# EAGLE schematic Schmatic (EAGLE 9.5.0)
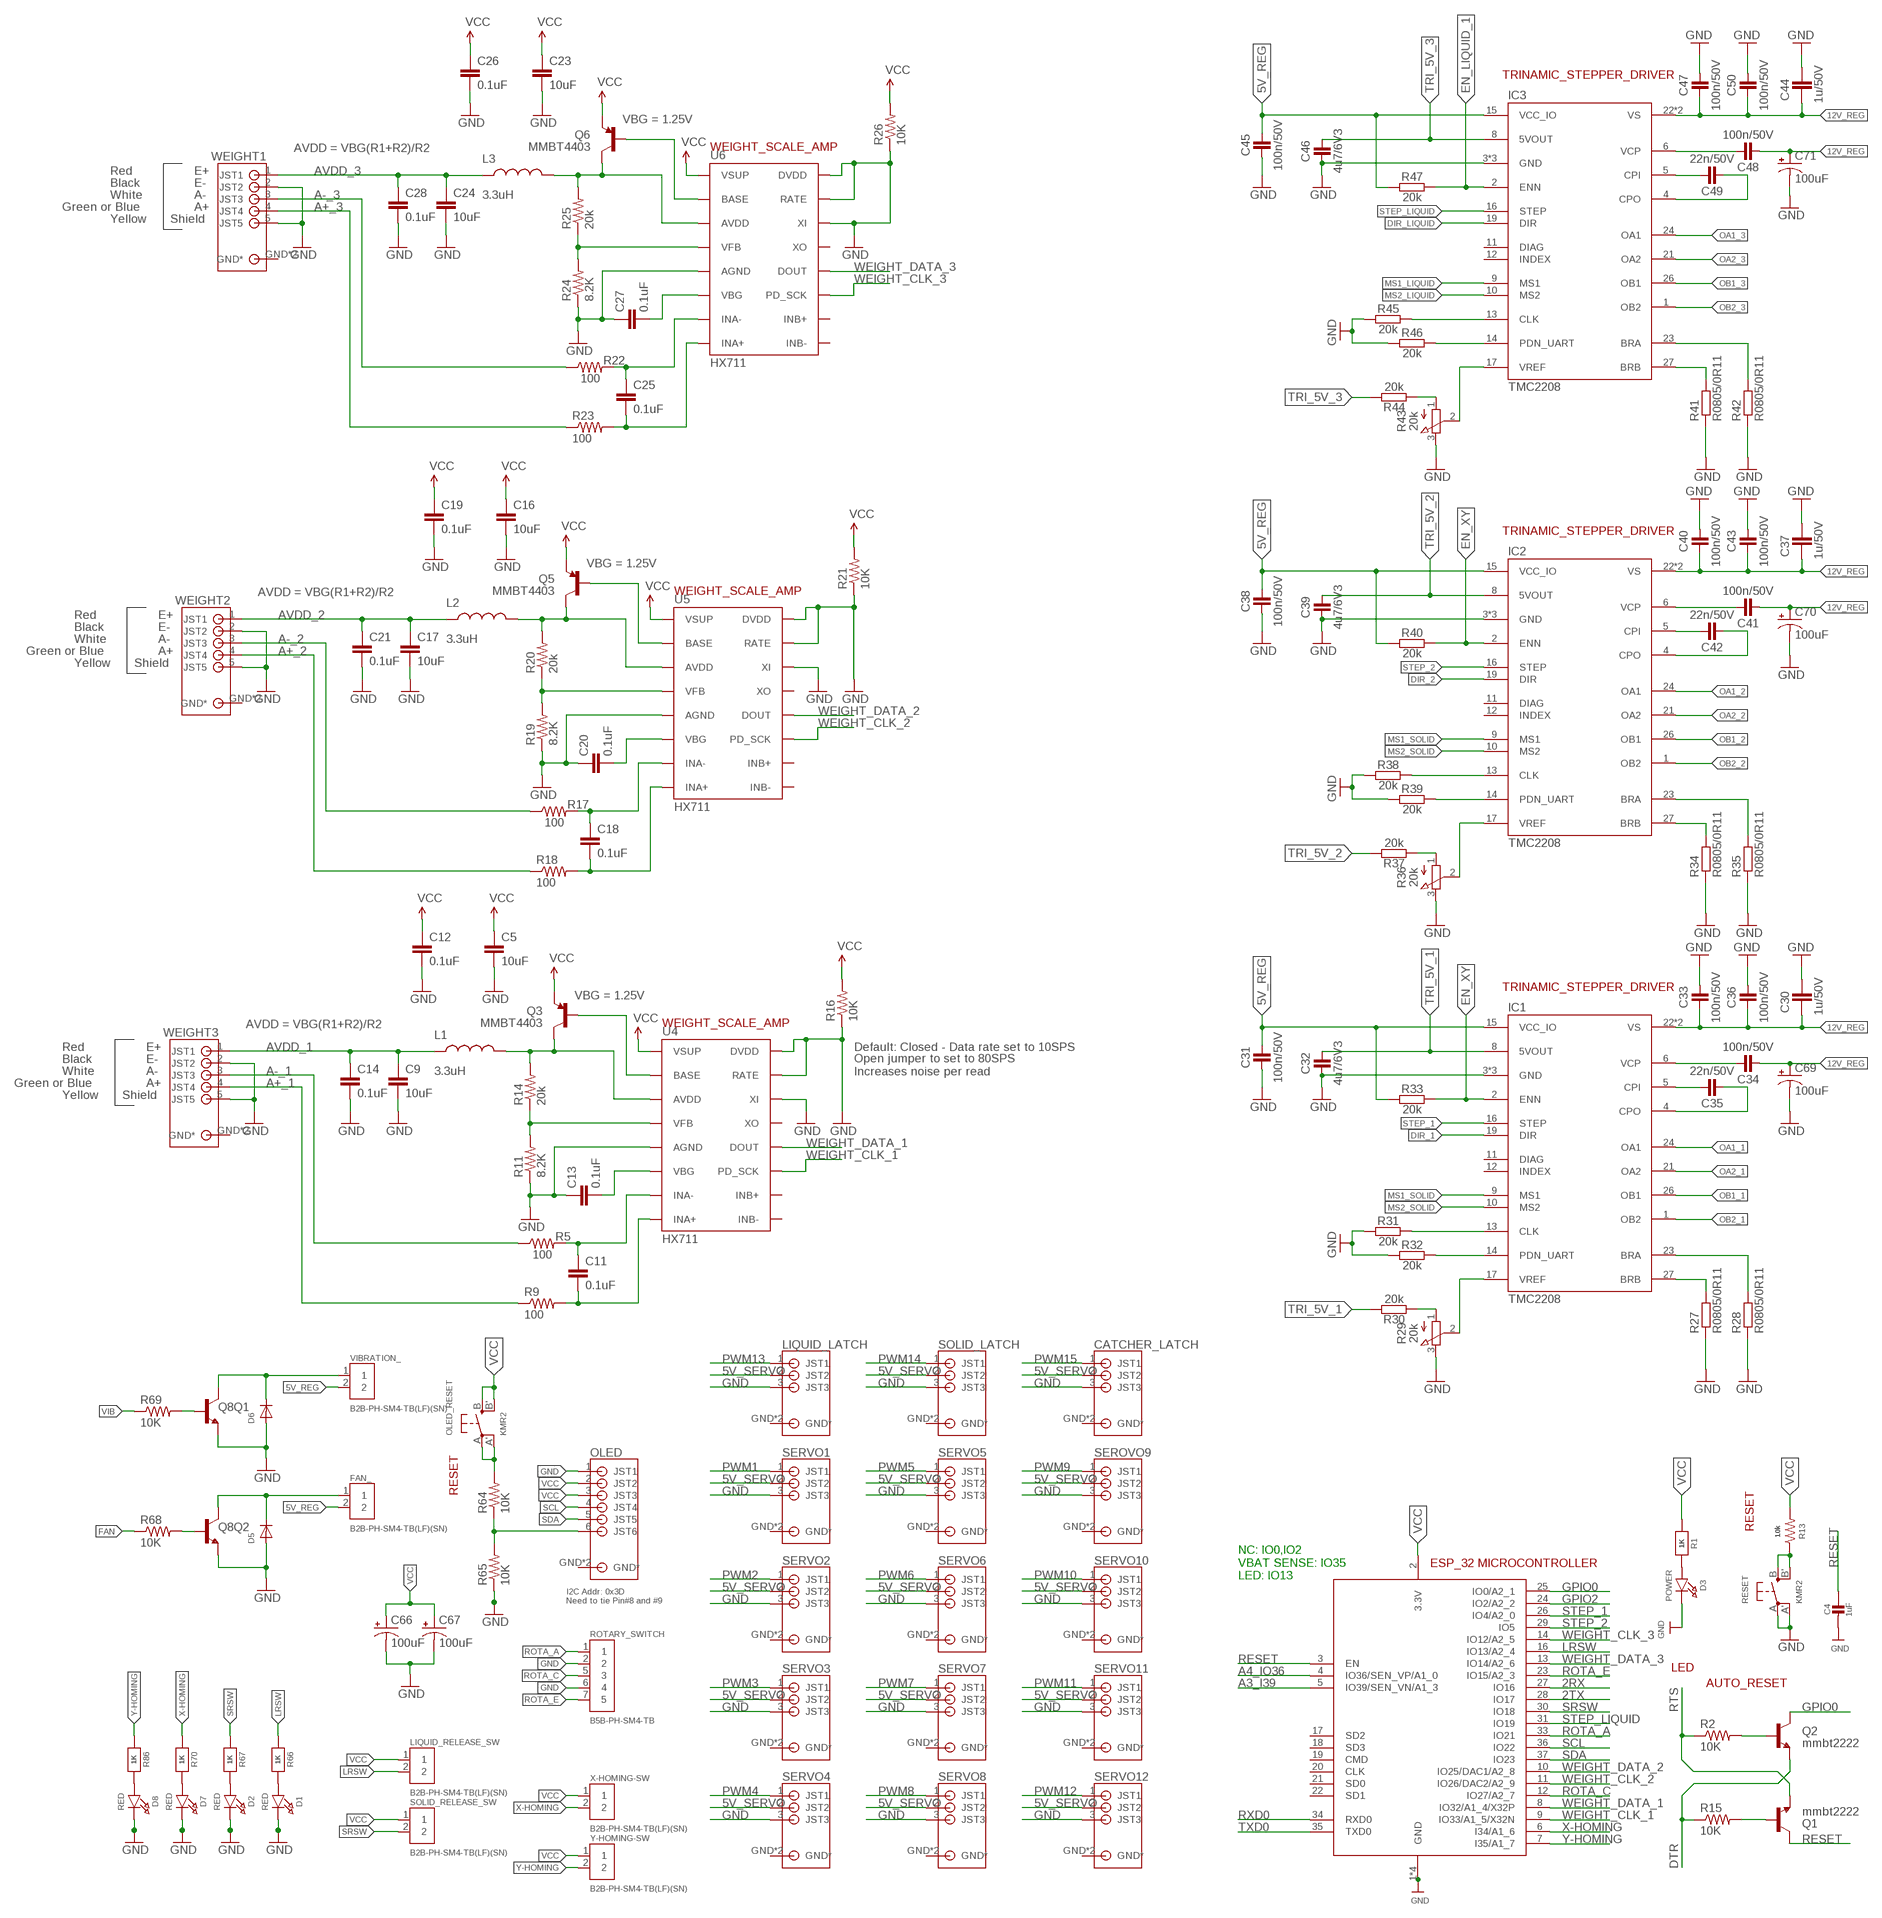
[diagram p0: schematic, sheet 1, part 1 of 2]
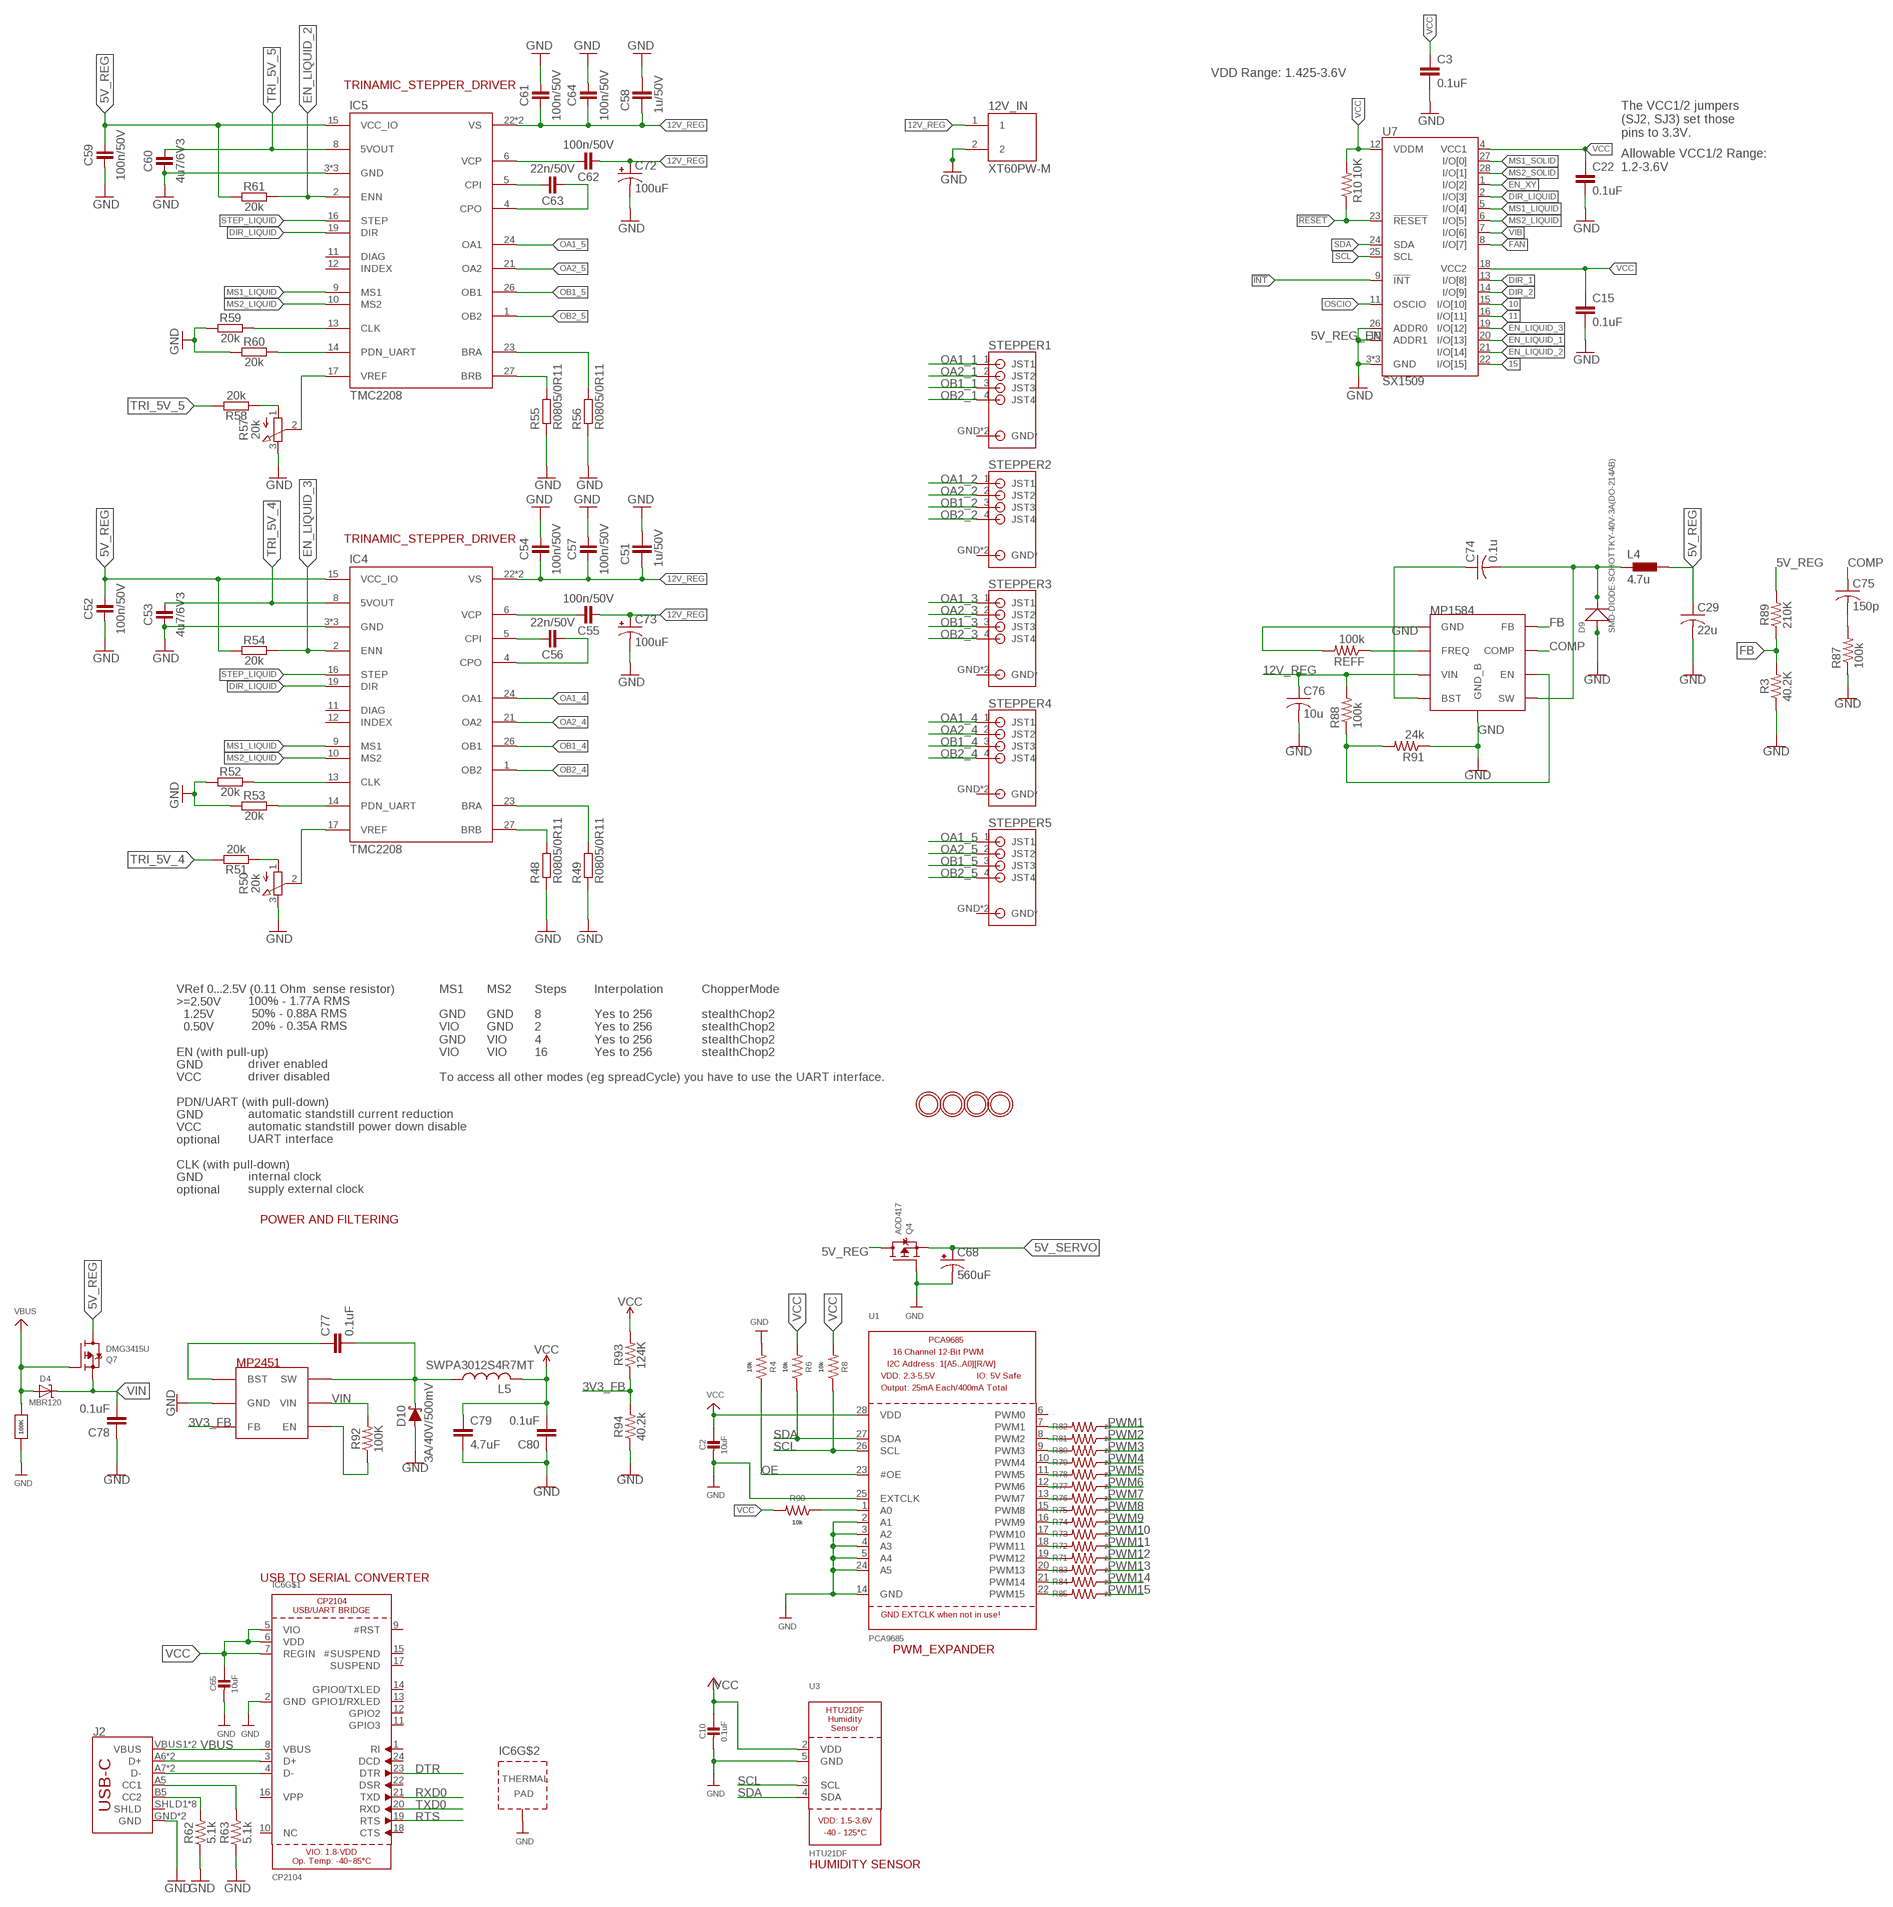
[diagram p1: schematic, sheet 1, part 2 of 2]

## Parts
12V_IN  XT60PW-M  [AMASS_XT60PW-M]
C2  10uF  CAP_CERAMIC0805-NOOUTLINE  [0805-NO]
C3  0.1uF  0.1UF-25V(+80/-20%)(0603)  [0603-CAP]
C4  1uF  CAP_CERAMIC0603_NO  [0603-NO]
C5  10uF  10UF50V20%(1210)  [1210]
C9  10uF  10UF50V20%(1210)  [1210]
C10  0.1uF  CAP_CERAMIC0805-NOOUTLINE  [0805-NO]
C11  0.1uF  0.1UF-25V-5%(0603)  [0603-CAP@1]
C12  0.1uF  0.1UF-25V-5%(0603)  [0603-CAP@1]
C13  0.1uF  0.1UF-25V-5%(0603)  [0603-CAP@1]
C14  0.1uF  0.1UF-25V-5%(0603)  [0603-CAP@1]
C15  0.1uF  0.1UF-25V(+80/-20%)(0603)  [0603-CAP]
C16  10uF  10UF50V20%(1210)  [1210]
C17  10uF  10UF50V20%(1210)  [1210]
C18  0.1uF  0.1UF-25V-5%(0603)  [0603-CAP@1]
C19  0.1uF  0.1UF-25V-5%(0603)  [0603-CAP@1]
C20  0.1uF  0.1UF-25V-5%(0603)  [0603-CAP@1]
C21  0.1uF  0.1UF-25V-5%(0603)  [0603-CAP@1]
C22  0.1uF  0.1UF-25V(+80/-20%)(0603)  [0603-CAP]
C23  10uF  10UF50V20%(1210)  [1210]
C24  10uF  10UF50V20%(1210)  [1210]
C25  0.1uF  0.1UF-25V-5%(0603)  [0603-CAP@1]
C26  0.1uF  0.1UF-25V-5%(0603)  [0603-CAP@1]
C27  0.1uF  0.1UF-25V-5%(0603)  [0603-CAP@1]
C28  0.1uF  0.1UF-25V-5%(0603)  [0603-CAP@1]
C29  22u  C-USC1206  [C1206]
C30  1u/50V  C-EUC0805  [C0805]
C31  100n/50V  CAPACITOR-0402  [C0402]
C32  4u7/6V3  CAPACITOR-0402  [C0402]
C33  100n/50V  CAPACITOR-0402  [C0402]
C34  100n/50V  CAPACITOR-0402  [C0402]
C35  22n/50V  CAPACITOR-0402  [C0402]
C36  100n/50V  CAPACITOR-0402  [C0402]
C37  1u/50V  C-EUC0805  [C0805]
C38  100n/50V  CAPACITOR-0402  [C0402]
C39  4u7/6V3  CAPACITOR-0402  [C0402]
C40  100n/50V  CAPACITOR-0402  [C0402]
C41  100n/50V  CAPACITOR-0402  [C0402]
C42  22n/50V  CAPACITOR-0402  [C0402]
C43  100n/50V  CAPACITOR-0402  [C0402]
C44  1u/50V  C-EUC0805  [C0805]
C45  100n/50V  CAPACITOR-0402  [C0402]
C46  4u7/6V3  CAPACITOR-0402  [C0402]
C47  100n/50V  CAPACITOR-0402  [C0402]
C48  100n/50V  CAPACITOR-0402  [C0402]
C49  22n/50V  CAPACITOR-0402  [C0402]
C50  100n/50V  CAPACITOR-0402  [C0402]
C51  1u/50V  C-EUC0805  [C0805]
C52  100n/50V  CAPACITOR-0402  [C0402]
C53  4u7/6V3  CAPACITOR-0402  [C0402]
C54  100n/50V  CAPACITOR-0402  [C0402]
C55  100n/50V  CAPACITOR-0402  [C0402]
C56  22n/50V  CAPACITOR-0402  [C0402]
C57  100n/50V  CAPACITOR-0402  [C0402]
C58  1u/50V  C-EUC0805  [C0805]
C59  100n/50V  CAPACITOR-0402  [C0402]
C60  4u7/6V3  CAPACITOR-0402  [C0402]
C61  100n/50V  CAPACITOR-0402  [C0402]
C62  100n/50V  CAPACITOR-0402  [C0402]
C63  22n/50V  CAPACITOR-0402  [C0402]
C64  100n/50V  CAPACITOR-0402  [C0402]
C65  10uF  CAP_CERAMIC0805-NOOUTLINE  [0805-NO]
C66  100uF  100UF-POLAR-25V-20%(ELEC)  [PANASONIC_D]
C67  100uF  100UF-POLAR-25V-20%(ELEC)  [PANASONIC_D]
C68  560uF  560UF-PANASONIC_G-25V-20%  [PANASONIC_G]
C69  100uF  100UF-POLAR-25V-20%(ELEC)  [PANASONIC_D]
C70  100uF  100UF-POLAR-25V-20%(ELEC)  [PANASONIC_D]
C71  100uF  100UF-POLAR-25V-20%(ELEC)  [PANASONIC_D]
C72  100uF  100UF-POLAR-25V-20%(ELEC)  [PANASONIC_D]
C73  100uF  100UF-POLAR-25V-20%(ELEC)  [PANASONIC_D]
C74  0.1u  C-USC0603  [C0603]
C75  150p  C-USC0603  [C0603]
C76  10u  C-USC1206  [C1206]
C77  0.1uF  0.1UF-0603-25V-(+80/-20%)  [0603]
C78  0.1uF  0.1UF-0603-25V-(+80/-20%)  [0603]
C79  4.7uF  4.7UF-1206-16V-(+80/-20%)  [1206]
C80  0.1uF  0.1UF-0603-25V-(+80/-20%)  [0603]
CATCHER_LATCH  S3B-PH-SM4_TB  [S3B-PH-SM4_TB]
D1  RED  LED0805_NOOUTLINE  [CHIPLED_0805_NOOUTLINE]
D2  RED  LED0805_NOOUTLINE  [CHIPLED_0805_NOOUTLINE]
D3  POWER  LED0805_NOOUTLINE  [CHIPLED_0805_NOOUTLINE]
D4  MBR120  DIODE-SCHOTTKYSOD-123  [SOD-123]
D5  DIODESOD-323F  [SOD-323F]
D6  DIODESOD-323F  [SOD-323F]
D7  RED  LED0805_NOOUTLINE  [CHIPLED_0805_NOOUTLINE]
D8  RED  LED0805_NOOUTLINE  [CHIPLED_0805_NOOUTLINE]
D9  SMD-DIODE-SCHOTTKY-40V-3A(DO-214AB)  [DO-214AB]
D10  3A/40V/500mV  DIODE-SCHOTTKY-B340A  [SMA-DIODE]
FAN_  B2B-PH-SM4-TB(LF)(SN)  [JST_B2B-PH-SM4-TB(LF)(SN)]
IC1  TMC2208  [QFN28-PAD]
IC2  TMC2208  [QFN28-PAD]
IC3  TMC2208  [QFN28-PAD]
IC4  TMC2208  [QFN28-PAD]
IC5  TMC2208  [QFN28-PAD]
IC6  CP2104  [QFN24_4MM_SMSC]
J2  USB_C16PIN  [USB-C-16P]
L1  3.3uH  INDUCTOR0805-IND  [0805]
L2  3.3uH  INDUCTOR0805-IND  [0805]
L3  3.3uH  INDUCTOR0805-IND  [0805]
L4  4.7u  MHCI0603-4R7M-R8  [MHCI0603-4R7M-R8]
L5  SWPA3012S4R7MT  L-USL3230M  [L3230M]
LIQUID_LATCH  S3B-PH-SM4_TB  [S3B-PH-SM4_TB]
LIQUID_RELEASE_SW  B2B-PH-SM4-TB(LF)(SN)  [JST_B2B-PH-SM4-TB(LF)(SN)]
MP2451  MP2451  [TSOT-23-6-SOT-23-6]
OLED  S6B-PH-SM4_TB  [S6B-PH-SM4_TB]
OLED_RESET  KMR2  SWITCH_TACT_SMT4.6X2.8  [BTN_KMR2_4.6X2.8]
Q1  mmbt2222  TRANSISTOR_NPNSOT23-3  [SOT23-3]
Q2  mmbt2222  TRANSISTOR_NPNSOT23-3  [SOT23-3]
Q3  MMBT4403  TRANSISTOR_PNPMMBT4403  [SOT23-3]
Q4  AOD417  MOSFET-PTO252  [TO252]
Q5  MMBT4403  TRANSISTOR_PNPMMBT4403  [SOT23-3]
Q6  MMBT4403  TRANSISTOR_PNPMMBT4403  [SOT23-3]
Q7  DMG3415U  MOSFET-P  [SOT23-R]
Q8  TRANS_NPN_DUAL-MBT3904DW1T1  [SC70-6]
R1  1K  RESISTOR_0603_NOOUT  [0603-NO]
R2  10K  10KOHM-1/10W-1%(0603)0603  [0603-RES]
R3  40.2K  220KOHM-0603-1/10W-1%  [0603]
R4  10k  10KOHM-0603-1/10W-1%  [0603]
R5  100  100OHM-1/10W-1%(0603)  [0603-RES@1]
R6  10k  10KOHM-0603-1/10W-1%  [0603]
R8  10k  10KOHM-0603-1/10W-1%  [0603]
R9  100  100OHM-1/10W-1%(0603)  [0603-RES@1]
R10  10K  10KOHM-1/10W-1%(0603)0603  [0603-RES]
R11  8.2K  8.2KOHM-1/10W-5%(0603)  [0603-RES@1]
R12  100K  RESISTOR_0603_NOOUT  [0603-NO]
R13  10k  10KOHM-0603-1/10W-1%  [0603]
R14  20k  20KOHM1/10W1%(0603)  [0603-RES@1]
R15  10K  10KOHM-1/10W-1%(0603)0603  [0603-RES]
R16  10K  10KOHM-1/10W-1%(0603)0603  [0603-RES]
R17  100  100OHM-1/10W-1%(0603)  [0603-RES@1]
R18  100  100OHM-1/10W-1%(0603)  [0603-RES@1]
R19  8.2K  8.2KOHM-1/10W-5%(0603)  [0603-RES@1]
R20  20k  20KOHM1/10W1%(0603)  [0603-RES@1]
R21  10K  10KOHM-1/10W-1%(0603)0603  [0603-RES]
R22  100  100OHM-1/10W-1%(0603)  [0603-RES@1]
R23  100  100OHM-1/10W-1%(0603)  [0603-RES@1]
R24  8.2K  8.2KOHM-1/10W-5%(0603)  [0603-RES@1]
R25  20k  20KOHM1/10W1%(0603)  [0603-RES@1]
R26  10K  10KOHM-1/10W-1%(0603)0603  [0603-RES]
R27  R0805/0R11  R-EU_M0805  [M0805]
R28  R0805/0R11  R-EU_M0805  [M0805]
R29  20k  POT-EVM3R  [POT_EVM3R]
R30  20k  RESISTOR-0402  [C0402]
R31  20k  RESISTOR-0402  [C0402]
R32  20k  RESISTOR-0402  [C0402]
R33  20k  RESISTOR-0402  [C0402]
R34  R0805/0R11  R-EU_M0805  [M0805]
R35  R0805/0R11  R-EU_M0805  [M0805]
R36  20k  POT-EVM3R  [POT_EVM3R]
R37  20k  RESISTOR-0402  [C0402]
R38  20k  RESISTOR-0402  [C0402]
R39  20k  RESISTOR-0402  [C0402]
R40  20k  RESISTOR-0402  [C0402]
R41  R0805/0R11  R-EU_M0805  [M0805]
R42  R0805/0R11  R-EU_M0805  [M0805]
R43  20k  POT-EVM3R  [POT_EVM3R]
R44  20k  RESISTOR-0402  [C0402]
R45  20k  RESISTOR-0402  [C0402]
R46  20k  RESISTOR-0402  [C0402]
R47  20k  RESISTOR-0402  [C0402]
R48  R0805/0R11  R-EU_M0805  [M0805]
R49  R0805/0R11  R-EU_M0805  [M0805]
R50  20k  POT-EVM3R  [POT_EVM3R]
R51  20k  RESISTOR-0402  [C0402]
R52  20k  RESISTOR-0402  [C0402]
R53  20k  RESISTOR-0402  [C0402]
R54  20k  RESISTOR-0402  [C0402]
R55  R0805/0R11  R-EU_M0805  [M0805]
R56  R0805/0R11  R-EU_M0805  [M0805]
R57  20k  POT-EVM3R  [POT_EVM3R]
R58  20k  RESISTOR-0402  [C0402]
R59  20k  RESISTOR-0402  [C0402]
R60  20k  RESISTOR-0402  [C0402]
R61  20k  RESISTOR-0402  [C0402]
R62  5.1k  5.1KOHM5.1KOHM-0603-1/10W-1%  [0603]
R63  5.1k  5.1KOHM5.1KOHM-0603-1/10W-1%  [0603]
R64  10K  10KOHM-1/10W-1%(0603)0603  [0603-RES]
R65  10K  10KOHM-1/10W-1%(0603)0603  [0603-RES]
R66  1K  RESISTOR_0603_NOOUT  [0603-NO]
R67  1K  RESISTOR_0603_NOOUT  [0603-NO]
R68  10K  10KOHM-1/10W-1%(0603)0603  [0603-RES]
R69  10K  10KOHM-1/10W-1%(0603)0603  [0603-RES]
R70  1K  RESISTOR_0603_NOOUT  [0603-NO]
R71  22  22OHM-0603-1/10W-1%  [0603]
R72  22  22OHM-0603-1/10W-1%  [0603]
R73  22  22OHM-0603-1/10W-1%  [0603]
R74  22  22OHM-0603-1/10W-1%  [0603]
R75  22  22OHM-0603-1/10W-1%  [0603]
R76  22  22OHM-0603-1/10W-1%  [0603]
R77  22  22OHM-0603-1/10W-1%  [0603]
R78  22  22OHM-0603-1/10W-1%  [0603]
R79  22  22OHM-0603-1/10W-1%  [0603]
R80  22  22OHM-0603-1/10W-1%  [0603]
R81  22  22OHM-0603-1/10W-1%  [0603]
R82  22  22OHM-0603-1/10W-1%  [0603]
R83  22  22OHM-0603-1/10W-1%  [0603]
R84  22  22OHM-0603-1/10W-1%  [0603]
R85  22  22OHM-0603-1/10W-1%  [0603]
R86  1K  RESISTOR_0603_NOOUT  [0603-NO]
R87  100k  R-US_R0603  [R0603]
R88  100k  R-US_R0603  [R0603]
R89  210K  RESISTOR0603  [0603]
R90  10k  10KOHM-0603-1/10W-1%  [0603]
R91  24k  R-US_R0603  [R0603]
R92  100K  RESISTOR0603  [0603]
R93  124K  RESISTOR0603  [0603]
R94  40.2k  RESISTOR0603  [0603]
REFF  100k  R-US_R0603  [R0603]
RESET  KMR2  SWITCH_TACT_SMT4.6X2.8  [BTN_KMR2_4.6X2.8]
ROTARY_SWITCH  B5B-PH-SM4-TB  [JST_B5B-PH-SM4-TB]
SEROVO9  S3B-PH-SM4_TB  [S3B-PH-SM4_TB]
SERVO1  S3B-PH-SM4_TB  [S3B-PH-SM4_TB]
SERVO2  S3B-PH-SM4_TB  [S3B-PH-SM4_TB]
SERVO3  S3B-PH-SM4_TB  [S3B-PH-SM4_TB]
SERVO4  S3B-PH-SM4_TB  [S3B-PH-SM4_TB]
SERVO5  S3B-PH-SM4_TB  [S3B-PH-SM4_TB]
SERVO6  S3B-PH-SM4_TB  [S3B-PH-SM4_TB]
SERVO7  S3B-PH-SM4_TB  [S3B-PH-SM4_TB]
SERVO8  S3B-PH-SM4_TB  [S3B-PH-SM4_TB]
SERVO10  S3B-PH-SM4_TB  [S3B-PH-SM4_TB]
SERVO11  S3B-PH-SM4_TB  [S3B-PH-SM4_TB]
SERVO12  S3B-PH-SM4_TB  [S3B-PH-SM4_TB]
SOLID_LATCH  S3B-PH-SM4_TB  [S3B-PH-SM4_TB]
SOLID_RELEASE_SW  B2B-PH-SM4-TB(LF)(SN)  [JST_B2B-PH-SM4-TB(LF)(SN)]
STEPPER1  S4B-PH-SM4_TB  [S4B-PH-SM4_TB]
STEPPER2  S4B-PH-SM4_TB  [S4B-PH-SM4_TB]
STEPPER3  S4B-PH-SM4_TB  [S4B-PH-SM4_TB]
STEPPER4  S4B-PH-SM4_TB  [S4B-PH-SM4_TB]
STEPPER5  S4B-PH-SM4_TB  [S4B-PH-SM4_TB]
U1  PCA9685  [TSSOP28]
U3  HTU21DF  [HTU21DF]
U4  HX711  HX711HX711  [SO16]
U5  HX711  HX711HX711  [SO16]
U6  HX711  HX711HX711  [SO16]
U7  SX1509  [QFN-28]
U$2  MP1584_V2  [MP1584_V2]
U$4  MOUNTINGHOLE2.5  [MOUNTINGHOLE_2.5_PLATED]
U$48  MOUNTINGHOLE2.5  [MOUNTINGHOLE_2.5_PLATED]
U$49  MOUNTINGHOLE2.5  [MOUNTINGHOLE_2.5_PLATED]
U$50  MOUNTINGHOLE2.5  [MOUNTINGHOLE_2.5_PLATED]
VIBRATION_  B2B-PH-SM4-TB(LF)(SN)  [JST_B2B-PH-SM4-TB(LF)(SN)]
WEIGHT1  S5B-PH-SM4_TB  [S5B-PH-SM4_TB]
WEIGHT2  S5B-PH-SM4_TB  [S5B-PH-SM4_TB]
WEIGHT3  S5B-PH-SM4_TB  [S5B-PH-SM4_TB]
X2  ESP32_WROOM32_SKINNY  [WROOM32_SKINNY]
X-HOMING-SW  B2B-PH-SM4-TB(LF)(SN)  [JST_B2B-PH-SM4-TB(LF)(SN)]
Y-HOMING-SW  B2B-PH-SM4-TB(LF)(SN)  [JST_B2B-PH-SM4-TB(LF)(SN)]

## Nets
2RX [HighSpeedSig]: X2.27(IO16)
2TX [HighSpeedSig]: X2.28(IO17)
3V3_FB [sig]: MP2451.PIN3(FB) R93.1 R94.2
5V_REG [Power]: C29.1 C31.2 C38.2 C45.2 C52.2 C59.2 FAN_.2 IC1.15(VCC_IO) IC2.15(VCC_IO) IC3.15(VCC_IO) IC4.15(VCC_IO) IC5.15(VCC_IO) L4.P$2 Q4.3(D) Q7.3(D) R33.1 R40.1 R47.1 R54.1 R61.1 R89.2 VIBRATION_.2
5V_REG_EN: R88.1 R91.2 U$2.EN
5V_SERVO [Power]: C68.+ CATCHER_LATCH.2(JST2) LIQUID_LATCH.2(JST2) Q4.2(S) SEROVO9.2(JST2) SERVO1.2(JST2) SERVO2.2(JST2) SERVO3.2(JST2) SERVO4.2(JST2) SERVO5.2(JST2) SERVO6.2(JST2) SERVO7.2(JST2) SERVO8.2(JST2) SERVO10.2(JST2) SERVO11.2(JST2) SERVO12.2(JST2) SOLID_LATCH.2(JST2)
10: U7.15(I/O[10])
11: U7.16(I/O[11])
12V_REG [Power]: 12V_IN.1 C30.1 C33.1 C34.1 C36.1 C37.1 C40.1 C41.1 C43.1 C44.1 C47.1 C48.1 C50.1 C51.1 C54.1 C55.1 C57.1 C58.1 C61.1 C62.1 C64.1 C69.+ C70.+ C71.+ C72.+ C73.+ C76.1 IC1.22(VS) IC1.28(VS) IC2.22(VS) IC2.28(VS) IC3.22(VS) IC3.28(VS) IC4.22(VS) IC4.28(VS) IC5.22(VS) IC5.28(VS) R88.2 U$2.VIN
15: U7.22(I/O[15])
!INT: U7.9(!INT)
!RESET: R10.1 U7.23(!RESET)
A3_I39: X2.5(IO39/SEN_VN/A1_3)
A4_IO36: X2.4(IO36/SEN_VP/A1_0)
A+_1: R9.1 WEIGHT3.4(JST4)
A+_2: R18.1 WEIGHT2.4(JST4)
A+_3: R23.1 WEIGHT1.4(JST4)
A-_1: R5.1 WEIGHT3.3(JST3)
A-_2: R17.1 WEIGHT2.3(JST3)
A-_3: R22.1 WEIGHT1.3(JST3)
AVDD_1: C9.1 C14.1 L1.1 WEIGHT3.1(JST1)
AVDD_2: C17.1 C21.1 L2.1 WEIGHT2.1(JST1)
AVDD_3: C24.1 C28.1 L3.1 WEIGHT1.1(JST1)
BRA: IC1.23(BRA) R28.2
BRA1: IC2.23(BRA) R35.2
BRA2: IC3.23(BRA) R42.2
BRA3: IC4.23(BRA) R49.2
BRA4: IC5.23(BRA) R56.2
BRB: IC1.27(BRB) R27.2
BRB1: IC2.27(BRB) R34.2
BRB2: IC3.27(BRB) R41.2
BRB3: IC4.27(BRB) R48.2
BRB4: IC5.27(BRB) R55.2
BST: C74.1 U$2.BST
CC1: J2.A5(CC1) R63.2
CC2: J2.B5(CC2) R62.2
CLK_1: IC1.13(CLK) R31.2
CLK_2: IC2.13(CLK) R38.2
CLK_3: IC3.13(CLK) R45.2
CLK_4: IC4.13(CLK) R52.2
CLK_5: IC5.13(CLK) R59.2
COMP: C75.1 U$2.COMP
CPI: C35.2 IC1.5(CPI)
CPI1: C42.2 IC2.5(CPI)
CPI2: C49.2 IC3.5(CPI)
CPI3: C56.2 IC4.5(CPI)
CPI4: C63.2 IC5.5(CPI)
CPO: C35.1 IC1.4(CPO)
CPO1: C42.1 IC2.4(CPO)
CPO2: C49.1 IC3.4(CPO)
CPO3: C56.1 IC4.4(CPO)
CPO4: C63.1 IC5.4(CPO)
DIR_1: IC1.19(DIR) U7.13(I/O[8])
DIR_2: IC2.19(DIR) U7.14(I/O[9])
DIR_LIQUID: IC3.19(DIR) IC4.19(DIR) IC5.19(DIR) U7.2(I/O[3])
DTR: IC6.23(DTR) Q2.2(E) R15.1
EN_LIQUID_1: IC3.2(ENN) R47.2 U7.20(I/O[13])
EN_LIQUID_2: IC5.2(ENN) R61.2 U7.21(I/O[14])
EN_LIQUID_3: IC4.2(ENN) R54.2 U7.19(I/O[12])
EN_XY: IC1.2(ENN) IC2.2(ENN) R33.2 R40.2 U7.1(I/O[2])
FAN: R68.1 U7.8(I/O[7])
FAN_5V [LowPower]: D5.C FAN_.1 Q8.6(Q2:C)
FB: R3.2 R89.1 U$2.FB
FREQ: REFF.1 U$2.FREQ
GND [Power]: 12V_IN.2 C2.2 C3.2 C4.2 C5.2 C9.2 C10.2 C12.2 C13.1 C14.2 C15.2 C16.2 C17.2 C19.2 C20.1 C21.2 C22.2 C23.2 C24.2 C26.2 C27.1 C28.2 C29.2 C30.2 C31.1 C32.1 C33.2 C36.2 C37.2 C38.1 C39.1 C40.2 C43.2 C44.2 C45.1 C46.1 C47.2 C50.2 C51.2 C52.1 C53.1 C54.2 C57.2 C58.2 C59.1 C60.1 C61.2 C64.2 C65.2 C66.- C67.- C68.- C69.- C70.- C71.- C72.- C73.- C76.2 C78.1 C79.2 C80.1 CATCHER_LATCH.3(JST3) D1.C D2.C D3.C D5.A D6.A D7.C D8.C D9.1(+) D10.A IC1.3(GND) IC1.18(GND) IC1.TP(GND) IC2.3(GND) IC2.18(GND) IC2.TP(GND) IC3.3(GND) IC3.18(GND) IC3.TP(GND) IC4.3(GND) IC4.18(GND) IC4.TP(GND) IC5.3(GND) IC5.18(GND) IC5.TP(GND) IC6.2(GND) IC6.THERM(TP) J2.GND J2.GND2(GND) LIQUID_LATCH.3(JST3) MP2451.PIN2(GND) OLED.1(JST1) Q4.1(G) Q8.1(Q2:E) Q8.4(Q1:E) R3.1 R4.2 R11.1 R12.1 R16.1 R19.1 R21.1 R24.1 R26.1 R27.1 R28.1 R29.3(E) R31.1 R32.1 R34.1 R35.1 R36.3(E) R38.1 R39.1 R41.1 R42.1 R43.3(E) R45.1 R46.1 R48.1 R49.1 R50.3(E) R52.1 R53.1 R55.1 R56.1 R57.3(E) R59.1 R60.1 R62.1 R63.1 R65.1 R87.1 R91.1 R94.1 REFF.2 RESET.A'(P1) RESET.A(P) ROTARY_SWITCH.2 ROTARY_SWITCH.6 SEROVO9.3(JST3) SERVO1.3(JST3) SERVO2.3(JST3) SERVO3.3(JST3) SERVO4.3(JST3) SERVO5.3(JST3) SERVO6.3(JST3) SERVO7.3(JST3) SERVO8.3(JST3) SERVO10.3(JST3) SERVO11.3(JST3) SERVO12.3(JST3) SOLID_LATCH.3(JST3) U1.2(A1) U1.3(A2) U1.4(A3) U1.5(A4) U1.14(GND) U1.24(A5) U1.25(EXTCLK) U3.5(GND) U4.5(AGND) U4.14(XI) U4.15(RATE) U4.16(DVDD) U5.5(AGND) U5.14(XI) U5.15(RATE) U5.16(DVDD) U6.5(AGND) U6.14(XI) U6.15(RATE) U6.16(DVDD) U7.3(GND) U7.10(ADDR1) U7.17(GND) U7.26(ADDR0) U7.29(GND) U$2.GND U$2.GND_B WEIGHT1.2(JST2) WEIGHT1.5(JST5) WEIGHT2.2(JST2) WEIGHT2.5(JST5) WEIGHT3.2(JST2) WEIGHT3.5(JST5) X2.1(GND) X2.15(GND) X2.38(GND) X2.P$1(GND)
GPIO0: Q2.3(C) X2.25(IO0/A2_1)
GPIO2: X2.24(IO2/A2_2)
LRSW [HighSpeedSig]: LIQUID_RELEASE_SW.2 R66.1 X2.16(IO13/A2_4)
MS1_LIQUID: IC3.9(MS1) IC4.9(MS1) IC5.9(MS1) U7.5(I/O[4])
MS1_SOLID: IC1.9(MS1) IC2.9(MS1) U7.27(I/O[0])
MS2_LIQUID: IC3.10(MS2) IC4.10(MS2) IC5.10(MS2) U7.6(I/O[5])
MS2_SOLID: IC1.10(MS2) IC2.10(MS2) U7.28(I/O[1])
N$1: C13.2 U4.6(VBG)
N$2: L1.2 Q3.3(C) R14.2 U4.3(AVDD)
N$3: Q5.1(B) U5.2(BASE)
N$4: Q3.1(B) U4.2(BASE)
N$5: D3.A R1.2
N$6: R11.2 R14.1 U4.4(VFB)
N$8: C11.1 R5.2 U4.7(INA-)
N$9: C11.2 R9.2 U4.8(INA+)
N$10: C75.2 R87.2
N$11: R19.2 R20.1 U5.4(VFB)
N$12: Q1.1(B) R15.2
N$13: Q2.1(B) R2.2
N$14: C20.2 U5.6(VBG)
N$15: L2.2 Q5.3(C) R20.2 U5.3(AVDD)
N$16: C18.1 R17.2 U5.7(INA-)
N$17: C18.2 R18.2 U5.8(INA+)
N$18: OLED_RESET.A'(P1) OLED_RESET.A(P) R64.2
N$19: Q6.1(B) U6.2(BASE)
N$20: R24.2 R25.1 U6.4(VFB)
N$21: C27.2 U6.6(VBG)
N$22: L3.2 Q6.3(C) R25.2 U6.3(AVDD)
N$23: C25.1 R22.2 U6.7(INA-)
N$24: C25.2 R23.2 U6.8(INA+)
N$25 [sig]: MP2451.PIN4(EN) R92.1
N$27: IC6.3(D+) J2.A6(D+) J2.B6(D+)
N$28: IC6.4(D-) J2.A7(D-) J2.B7(D-)
N$29 [Power]: C77.1 MP2451.PIN1(BST)
N$30 [Power]: R90.1 U1.1(A0)
N$31 [Power]: C77.2 D10.C L5.1 MP2451.PIN6(SW)
N$33 [sig]: D1.A R66.2
N$34: OLED.6(JST6) R64.1 R65.2
N$35: Q8.5(Q1:B) R69.2
N$36 [sig]: D2.A R67.2
N$37: Q8.2(Q2:B) R68.2
N$38: R71.2 U1.19(PWM12)
N$39: R72.2 U1.18(PWM11)
N$40: R73.2 U1.17(PWM10)
N$41: R74.2 U1.16(PWM9)
N$42: R75.2 U1.15(PWM8)
N$43: R76.2 U1.13(PWM7)
N$44: R77.2 U1.12(PWM6)
N$45: R78.2 U1.11(PWM5)
N$46: R79.2 U1.10(PWM4)
N$47: R80.2 U1.9(PWM3)
N$48: R81.2 U1.8(PWM2)
N$49: R82.2 U1.7(PWM1)
N$50: R83.2 U1.20(PWM13)
N$51: R84.2 U1.21(PWM14)
N$52: R85.2 U1.22(PWM15)
N$53 [sig]: D7.A R70.2
N$54: R13.1 RESET.B'(S1) RESET.B(S)
N$55 [sig]: D8.A R86.2
OA1_1 [StepperOut]: IC1.24(OA1) STEPPER1.1(JST1)
OA1_2 [StepperOut]: IC2.24(OA1) STEPPER2.1(JST1)
OA1_3 [StepperOut]: IC3.24(OA1) STEPPER3.1(JST1)
OA1_4 [StepperOut]: IC4.24(OA1) STEPPER4.1(JST1)
OA1_5 [StepperOut]: IC5.24(OA1) STEPPER5.1(JST1)
OA2_1 [StepperOut]: IC1.21(OA2) STEPPER1.2(JST2)
OA2_2 [StepperOut]: IC2.21(OA2) STEPPER2.2(JST2)
OA2_3 [StepperOut]: IC3.21(OA2) STEPPER3.2(JST2)
OA2_4 [StepperOut]: IC4.21(OA2) STEPPER4.2(JST2)
OA2_5 [StepperOut]: IC5.21(OA2) STEPPER5.2(JST2)
OB1_1 [StepperOut]: IC1.26(OB1) STEPPER1.3(JST3)
OB1_2 [StepperOut]: IC2.26(OB1) STEPPER2.3(JST3)
OB1_3 [StepperOut]: IC3.26(OB1) STEPPER3.3(JST3)
OB1_4 [StepperOut]: IC4.26(OB1) STEPPER4.3(JST3)
OB1_5 [StepperOut]: IC5.26(OB1) STEPPER5.3(JST3)
OB2_1 [StepperOut]: IC1.1(OB2) STEPPER1.4(JST4)
OB2_2 [StepperOut]: IC2.1(OB2) STEPPER2.4(JST4)
OB2_3 [StepperOut]: IC3.1(OB2) STEPPER3.4(JST4)
OB2_4 [StepperOut]: IC4.1(OB2) STEPPER4.4(JST4)
OB2_5 [StepperOut]: IC5.1(OB2) STEPPER5.4(JST4)
OE: R4.1 U1.23(#OE)
OSCIO: U7.11(OSCIO)
PDN_UART_1: IC1.14(PDN_UART) R32.2
PDN_UART_2: IC2.14(PDN_UART) R39.2
PDN_UART_3: IC3.14(PDN_UART) R46.2
PDN_UART_4: IC4.14(PDN_UART) R53.2
PDN_UART_5: IC5.14(PDN_UART) R60.2
PWM1: R82.1 SERVO1.1(JST1)
PWM2: R81.1 SERVO2.1(JST1)
PWM3: R80.1 SERVO3.1(JST1)
PWM4: R79.1 SERVO4.1(JST1)
PWM5: R78.1 SERVO5.1(JST1)
PWM6: R77.1 SERVO6.1(JST1)
PWM7: R76.1 SERVO7.1(JST1)
PWM8: R75.1 SERVO8.1(JST1)
PWM9: R74.1 SEROVO9.1(JST1)
PWM10: R73.1 SERVO10.1(JST1)
PWM11: R72.1 SERVO11.1(JST1)
PWM12: R71.1 SERVO12.1(JST1)
PWM13: LIQUID_LATCH.1(JST1) R83.1
PWM14: R84.1 SOLID_LATCH.1(JST1)
PWM15: CATCHER_LATCH.1(JST1) R85.1
RESET: C4.1 Q1.3(C) X2.3(EN)
ROTA_A [HighSpeedSig]: ROTARY_SWITCH.1 X2.33(IO21)
ROTA_C [HighSpeedSig]: ROTARY_SWITCH.5 X2.12(IO27/A2_7)
ROTA_E [HighSpeedSig]: ROTARY_SWITCH.7 X2.23(IO15/A2_3)
RTS: IC6.19(RTS) Q1.2(E) R2.1
RXD0 [HighSpeedSig]: IC6.21(TXD) X2.34(RXD0)
SCL [HighSpeedSig]: OLED.4(JST4) R8.1 U1.26(SCL) U3.3(SCL) U7.25(SCL) X2.36(IO22)
SDA [HighSpeedSig]: OLED.5(JST5) R6.1 U1.27(SDA) U3.4(SDA) U7.24(SDA) X2.37(IO23)
SRSW [HighSpeedSig]: R67.1 SOLID_RELEASE_SW.2 X2.30(IO18)
STEP_1 [HighSpeedSig]: IC1.16(STEP) X2.26(IO4/A2_0)
STEP_2 [HighSpeedSig]: IC2.16(STEP) X2.29(IO5)
STEP_LIQUID [HighSpeedSig]: IC3.16(STEP) IC4.16(STEP) IC5.16(STEP) X2.31(IO19)
SW: C74.2 D9.2(-) L4.P$1 U$2.SW
TRI_5V_1: C32.2 IC1.8(5VOUT) R30.2
TRI_5V_2: C39.2 IC2.8(5VOUT) R37.2
TRI_5V_3: C46.2 IC3.8(5VOUT) R44.2
TRI_5V_4: C53.2 IC4.8(5VOUT) R51.2
TRI_5V_5: C60.2 IC5.8(5VOUT) R58.2
TXD0 [HighSpeedSig]: IC6.20(RXD) X2.35(TXD0)
VBUS [LowPower]: D4.A IC6.8(VBUS) J2.VBUS1(VBUS) J2.VBUS2(VBUS) Q7.1(G) R12.2
VCC [LowPower]: C2.1 C3.1 C5.1 C10.1 C12.1 C15.1 C16.1 C19.1 C22.1 C23.1 C26.1 C65.1 C66.+ C67.+ C79.1 C80.2 IC6.5(VIO) IC6.6(VDD) IC6.7(REGIN) L5.2 LIQUID_RELEASE_SW.1 OLED.2(JST2) OLED.3(JST3) OLED_RESET.B'(S1) OLED_RESET.B(S) Q3.2(E) Q5.2(E) Q6.2(E) R1.1 R6.2 R8.2 R10.2 R13.2 R16.2 R21.2 R26.2 R90.2 R93.2 SOLID_RELEASE_SW.1 U1.28(VDD) U3.2(VDD) U4.1(VSUP) U5.1(VSUP) U6.1(VSUP) U7.4(VCC1) U7.12(VDDM) U7.18(VCC2) X2.2(3.3V) X-HOMING-SW.1 Y-HOMING-SW.1 ; supply symbol labelled +3V3
VCP: C34.2 IC1.6(VCP)
VCP1: C41.2 IC2.6(VCP)
VCP2: C48.2 IC3.6(VCP)
VCP3: C55.2 IC4.6(VCP)
VCP4: C62.2 IC5.6(VCP)
VIB: R69.1 U7.7(I/O[6])
VIB_5V [LowPower]: D6.C Q8.3(Q1:C) VIBRATION_.1
VIN: C78.2 D4.C MP2451.PIN5(VIN) Q7.2(S) R92.2
VREF: IC1.17(VREF) R29.2(S)
VREF1: R29.1(A) R30.1
VREF2: IC2.17(VREF) R36.2(S)
VREF3: R36.1(A) R37.1
VREF4: IC3.17(VREF) R43.2(S)
VREF5: R43.1(A) R44.1
VREF6: IC4.17(VREF) R50.2(S)
VREF7: R50.1(A) R51.1
VREF8: IC5.17(VREF) R57.2(S)
VREF9: R57.1(A) R58.1
WEIGHT_CLK_1 [HighSpeedSig]: U4.11(PD_SCK) X2.9(IO33/A1_5/X32N)
WEIGHT_CLK_2 [HighSpeedSig]: U5.11(PD_SCK) X2.11(IO26/DAC2/A2_9)
WEIGHT_CLK_3 [HighSpeedSig]: U6.11(PD_SCK) X2.14(IO12/A2_5)
WEIGHT_DATA_1 [HighSpeedSig]: U4.12(DOUT) X2.8(IO32/A1_4/X32P)
WEIGHT_DATA_2 [HighSpeedSig]: U5.12(DOUT) X2.10(IO25/DAC1/A2_8)
WEIGHT_DATA_3 [HighSpeedSig]: U6.12(DOUT) X2.13(IO14/A2_6)
X-HOMING [HighSpeedSig]: R70.1 X2.6(I34/A1_6) X-HOMING-SW.2
Y-HOMING [HighSpeedSig]: R86.1 X2.7(I35/A1_7) Y-HOMING-SW.2
Unconnected: CATCHER_LATCH.GND2(GND*) CATCHER_LATCH.GND(GND*) IC1.11(DIAG) IC1.12(INDEX) IC2.11(DIAG) IC2.12(INDEX) IC3.11(DIAG) IC3.12(INDEX) IC4.11(DIAG) IC4.12(INDEX) IC5.11(DIAG) IC5.12(INDEX) IC6.1(RI) IC6.9(#RST) IC6.10(NC) IC6.11(GPIO3) IC6.12(GPIO2) IC6.13(GPIO1/RXLED) IC6.14(GPIO0/TXLED) IC6.15(#SUSPEND) IC6.16(VPP) IC6.17(SUSPEND) IC6.18(CTS) IC6.22(DSR) IC6.24(DCD) J2.SHLD1(SHLD) J2.SHLD2(SHLD) J2.SHLD3(SHLD) J2.SHLD4(SHLD) J2.SHLD5(SHLD) J2.SHLD6(SHLD) J2.SHLD7(SHLD) J2.SHLD8(SHLD) LIQUID_LATCH.GND2(GND*) LIQUID_LATCH.GND(GND*) OLED.GND2(GND*) OLED.GND(GND*) SEROVO9.GND2(GND*) SEROVO9.GND(GND*) SERVO1.GND2(GND*) SERVO1.GND(GND*) SERVO2.GND2(GND*) SERVO2.GND(GND*) SERVO3.GND2(GND*) SERVO3.GND(GND*) SERVO4.GND2(GND*) SERVO4.GND(GND*) SERVO5.GND2(GND*) SERVO5.GND(GND*) SERVO6.GND2(GND*) SERVO6.GND(GND*) SERVO7.GND2(GND*) SERVO7.GND(GND*) SERVO8.GND2(GND*) SERVO8.GND(GND*) SERVO10.GND2(GND*) SERVO10.GND(GND*) SERVO11.GND2(GND*) SERVO11.GND(GND*) SERVO12.GND2(GND*) SERVO12.GND(GND*) SOLID_LATCH.GND2(GND*) SOLID_LATCH.GND(GND*) STEPPER1.GND2(GND*) STEPPER1.GND(GND*) STEPPER2.GND2(GND*) STEPPER2.GND(GND*) STEPPER3.GND2(GND*) STEPPER3.GND(GND*) STEPPER4.GND2(GND*) STEPPER4.GND(GND*) STEPPER5.GND2(GND*) STEPPER5.GND(GND*) U1.6(PWM0) U4.9(INB-) U4.10(INB+) U4.13(XO) U5.9(INB-) U5.10(INB+) U5.13(XO) U6.9(INB-) U6.10(INB+) U6.13(XO) WEIGHT1.GND2(GND*) WEIGHT1.GND(GND*) WEIGHT2.GND2(GND*) WEIGHT2.GND(GND*) WEIGHT3.GND2(GND*) WEIGHT3.GND(GND*) X2.17(SD2) X2.18(SD3) X2.19(CMD) X2.20(CLK) X2.21(SD0) X2.22(SD1)

## Notes on the sheet
- VDD Range: 1.425-3.6V
- TRINAMIC_STEPPER_DRIVER | TRINAMIC_STEPPER_DRIVER
- VBG = 1.25V
- The VCC1/2 jumpers 
  (SJ2, SJ3) set those 
  pins to 3.3V.
- Allowable VCC1/2 Range: 
  1.2-3.6V
- AVDD = VBG(R1+R2)/R2 | WEIGHT_SCALE_AMP
- Red | E+
- Black | E-
- White | A-
- Green or Blue | A+
- Yellow | Shield
- TRINAMIC_STEPPER_DRIVER | TRINAMIC_STEPPER_DRIVER
- VBG = 1.25V
- AVDD = VBG(R1+R2)/R2 | WEIGHT_SCALE_AMP
- Red | E+
- Black | E-
- White | A-
- Green or Blue | A+
- Yellow | Shield
- VRef 0...2.5V (0.11 Ohm  sense resistor)
  >=2.50V
    1.25V
    0.50V
  
  EN (with pull-up)
  GND
  VCC
  
  PDN/UART (with pull-down)
  GND
  VCC
  optional
  
  CLK (with pull-down)
  GND
  optional
- MS1
  
  GND
  VIO
  GND
  VIO
  
  To access all other modes (eg spreadCycle) you have to use the UART interface.
- MS2
  
  GND
  GND
  VIO
  VIO
- Steps
  
  8
  2
  4
  16
- Interpolation
  
  Yes to 256
  Yes to 256
  Yes to 256
  Yes to 256
- ChopperMode
  
  stealthChop2
  stealthChop2
  stealthChop2
  stealthChop2
- TRINAMIC_STEPPER_DRIVER
- 100% - 1.77A RMS
   50% - 0.88A RMS
   20% - 0.35A RMS
  
  
  driver enabled
  driver disabled
  
  
  automatic standstill current reduction
  automatic standstill power down disable
  UART interface
  
  
  internal clock
  supply external clock
- VBG = 1.25V
- AVDD = VBG(R1+R2)/R2 | WEIGHT_SCALE_AMP
- Red | E+ | Default: Closed - Data rate set to 10SPS
- Black | E-
- White | A-
- Open jumper to set to 80SPS
  Increases noise per read
- Green or Blue | A+
- Yellow | Shield
- POWER AND FILTERING
- RESET
- RESET
- ESP_32 MICROCONTROLLER
- NC: IO0,IO2
  VBAT SENSE: IO35
  LED: IO13
- USB TO SERIAL CONVERTER
- I2C Addr: 0x3D
  Need to tie Pin#8 and #9
- PWM_EXPANDER
- LED
- AUTO_RESET
- HUMIDITY SENSOR

## Library data of the parts
12V_IN = XT60PW-M:XT60PW-M; AVAILABILITY: Unavailable; MF: AMASS; MP: XT60PW-M; PACKAGE: Package Analog Devices; PRICE: None
C2 C4 C10 C65 = microbuilder:CAP_CERAMIC: Ceramic Capacitors For new designs, use the packages preceded by an '_' character since they are more reliable: The following footprints should be used on most boards: _0402 - Standard footprint for regular board layouts _0603 - Standard footprint for regular board layouts _0805 - Standard footprint for regular board layouts _1206 - Standard footprint for regular board layouts For extremely tight-pitch boards where space is at a premium, the following 'micro-pitch' footprints can be used (smaller pads, no silkscreen outline, etc.): _0402MP - Micro-pitch footprint for very dense/compact boards _0603MP - Micro-pitch footprint for very dense/compact boards _0805MP - Micro-pitch footprint for very dense/compact boards _1206MP - Micro-pitch footprint for very dense/compact boards
C3 C15 C22 = SparkFun-Capacitors:0.1UF-25V(+80/-20%)(0603): CAP-00810 Ceramic Standard decoupling cap; PROD_ID: CAP-00810
C5 C9 C16 C17 C23 C24 = SparkFun-Capacitors:10UF50V20%(1210): CAP-09824; PROD_ID: CAP-09824
C11-C14 C18-C21 C25-C28 = SparkFun-Capacitors:0.1UF-25V-5%(0603): CAP-08604; PROD_ID: CAP-08604
C29 C74-C76 = adafruit:C-US: CAPACITOR, American symbol
C30 C37 C44 C51 C58 = rcl:C-EU: CAPACITOR, European symbol
C31-C36 C38-C43 C45-C50 C52-C57 C59-C64 = we-rcl:CAPACITOR: Capacitors ...2.2uF @ 6.3V -> 0402 ...4.7uF @ 6.3V -> 0603 ...10uF @ 16V -> 0805 ...22uF @ 25V -> 1206
C66 C67 C69-C73 = SparkFun-Capacitors:100UF-POLAR: 100µF polarized capacitors A capacitor is a passive two-terminal electrical component used to store electrical energy temporarily in an electric field.; PROD_ID: CAP-12547
C68 = SparkFun-Capacitors:560UF: 560µF polarized capacitors A capacitor is a passive two-terminal electrical component used to store electrical energy temporarily in an electric field.; PROD_ID: CAP-09983
C77 C78 C80 = SparkFun-Capacitors:0.1UF: 0.1µF ceramic capacitors A capacitor is a passive two-terminal electrical component used to store electrical energy temporarily in an electric field.; PROD_ID: CAP-00810
C79 = SparkFun-Capacitors:4.7UF: 4.7µF ceramic capacitors A capacitor is a passive two-terminal electrical component used to store electrical energy temporarily in an electric field.; PROD_ID: CAP-10300
CATCHER_LATCH LIQUID_LATCH SEROVO9 SERVO1-SERVO8 SERVO10-SERVO12 SOLID_LATCH = NewKevinMade:S3B-PH-SM4_TB
D1-D3 D7 D8 = microbuilder:LED: LED 0603 - 0603 Surface Mount Package 2mA: Green LED - Low Power (3.9mcd, 2ma, 1.7Vf) - Digikey: 475-2709-2-ND Orange LED - Low Power (9.8mcd, 2ma, 1.8Vf) - Digikey: 475-1194-2-ND Red LED - Low Power (5mcd, 2ma, 1.8Vf) - Digikey: 475-1195-2-ND Yellow LED - Low Power (7mcd, 2ma, 1.8Vf) - Digikey: 475-1196-2-ND 5mA: Blue LED - Low Power (17mcd, 5ma, 2.9Vf) - Digikey: LNJ937W8CRACT-ND 0805 - 0805 Surface Mount Package 2mA: Red LED (8.8mcd, 2mA, 1.8Vf, Clear) - Low Power [Digikey: 475-2510-1-ND] Green LED (5mcd, 2mA, 1.8Vf, Clear) - Low Power [Digikey: 475-2730-1-ND] Yellow LED (11.3mcd, 2mA, 1.8Vf, Clear) - Low Power [Digikey: 475-2555-1-ND] 20mA: Red LED (104mcd, 20mA, Diffused) - LS R976 [Digikey: 475-1278-6-ND] Red LED (12mcd, 20mA, 2.0Vf, Clear) - APT2012EC [Digikey: 754-1128-1-ND] Green LED (15mcd, 20mA, 2.2Vf, Clear) - APT2012GC [Digikey: 754-1131-1-ND] Orange LED (160mcd, 20mA, 2.1Vf, Clear) - APT2012SECK [Digikey: 754-1130-1-ND] 1206 - 1206 Surface Mount Package Green LED (26mcd, 20mA, Diffused) - LG N971 [Digikey: 475-1407-6-ND] Red LED (15mcd, 20mA, Diffused) - LH N974 [Digikey: 475-1416-6-ND] Cree - Cree High-Power Surface Mount LEDs XPEBWT-L1-0000-00D50 - White 111lm 350mA 2.9Vf 6200K 110° XTEAWT-00-0000-00000LEE3 - White 114lm 350mA 2.85Vf 5000K 115° Everlight - Everlight 45-21 Series Surface Mount LEDs 45-21/QK2C-B2832AC2CB2/2T - Warm White 2000mcd 20mA 3.25Vf 3050K 120° 45-21/LK2C-B38452C4CB2/2T - Nuetral White 2000mcd 20mA 3.25Vf 4150K 120° 45-21/LK2C-B50634C6CB2/2T - Cold White 2200mcd 20mA 3.25Vf 5650K 120° PLCC2 Reverse Mount LS T77K-J1L2-1-0-2-R18-Z - Red 11.25mcd 2mA 1.8Vf 630nm 120° LO T77K-L1M2-24-Z - Orange 19.6mcd 2mA 1.8Vf 606nm 120° LY T77K-K2M1-26-Z - Yellow 15.7mcd 2mA 1.8Vf 587nm 120°
D4 = microbuilder:DIODE-SCHOTTKY
D5 D6 = adafruit:DIODE: Diode SMADIODE - SMA Surface Mount Package 20V 1A Schottky Diode Digikey: 641-1014-6-ND DO-1N4148 - Through Hole Small Current Diode SOD-123 20V 1 A (.5mV Vf) Schottky Diode - Digikey: MBRX120TPMSCT-ND SOD-323 10V 570mA (.38mV Vf, 3ns) Schottky Diode - Digikey: ZLLS410CT-ND SOD-523 30V 30mA Schottky Diode (RB751S-40TE61) - Digikey: RB751S-40TE61CT-ND SOT23-R/W - SOT23 Package (R = Solder Paste/Reflow Ovens, W = Hand-Soldering) BAT54Film 40V 300mA - Digikey: 497-7162-1-ND
D9 = SMD-DIODE-SCHOTTKY-40V-3A_DO-214AB_:SMD-DIODE-SCHOTTKY-40V-3A(DO-214AB): 304020018; AVAILABILITY: Unavailable; DESCRIPTION: Rectifier, Schottky; DO-214AB; 3.0A IF; 0.75V; 40V; 100A IFRM; 10000V/us; 1000pF; MF: Vishay; MP: SS34-E3/57T; PACKAGE: DO-214 Vishay; PRICE: None
D10 = SparkFun-DiscreteSemi:DIODE-SCHOTTKY: Schottky diode A Schottky diode is a semiconductor diode which has a low forward voltage drop and a very fast switching action.; PROD_ID: DIO-09886
FAN_ LIQUID_RELEASE_SW SOLID_RELEASE_SW VIBRATION_ X-HOMING-SW Y-HOMING-SW = B2B-PH-SM4-TB_LF__SN_:B2B-PH-SM4-TB(LF)(SN): PH Series 2 Position 2 mm Pitch Surface Mount Top Entry Shrouded Header; AVAILABILITY: Unavailable; DESCRIPTION: PH Series 2 Position 2 mm Pitch Surface Mount Top Entry Shrouded Header; MF: JST Sales; MP: B2B-PH-SM4-TB_LF__SN_; PACKAGE: None; PRICE: None
IC1-IC5 = we-chip:TMC2208: Trinamic TMC2108 Stepper Motor Driver (5V...36V, 1.2A RMS, 256 microsteps)
IC6 = microbuilder:CP2104: CP2104 - USB to UART Bridge VDD Output: 3.45V
J2 = SparkFun-Connectors:USB_C: USB Type C 16Pin Connector Super Speed pins not available on the 16-pin purely SMD connector so this part is best for USB 2.0 implementations. D1 and D2 are tied together enabling D+/- no matter which way the cable is plugged into the connector. The two channel configuration pins (CC1/2) are exposed. These are normally connected to ground via 5.1k resistors but can be reconfigured for high current/high power applications.; PROD_ID: CONN-14122
L1-L3 = SparkFun-Passives:INDUCTOR: Inductors Basic Inductor/Choke - 0603 and 1206. Footprints are not proven and vary greatly between part numbers. INDUCTOR POWER 3.3UH 4.0A SMD 0.197" L x 0.197" W x 0.177" H (5.00mm x 5.00mm x 4.50mm); PROD_ID: NDUC-13076
L4 = NewKevinMade:MHCI0603-4R7M-R8
L5 = rcl:L-US: INDUCTOR, American symbol; SPICEPREFIX: L
MP2451 = NewKevinMade:MP2451
OLED = NewKevinMade:S6B-PH-SM4_TB
OLED_RESET RESET = microbuilder:SWITCH_TACT_SMT: SMT Tact Switches 6x6mm - Digikey: P12940SCT-ND KMR2 (4.6x2.8mm) - Digikey: 401-1426-1-ND EVQ-PQHB55 - Light Touch, 160GF (4.5x4.5mm) - Digikey: P8090SCT-ND KMT0 - KMT021 NGJ LHS (etc.) IP68/Waterproof - Digikey: CKN10289CT-ND
Q1 Q2 = SparkFun:TRANSISTOR_NPN: Transistor NPN BJT configuration in SOT23 package. MMBT2222 is the common NPN we use. Double check BCE configuration again layout.
Q3 Q5 Q6 = SparkFun-DiscreteSemi:TRANSISTOR_PNP: Generic PNP BJT Double check pinouts against datasheets- not all devices are the same! MMBT3906 - 40V 200mA SOT-23 (TRANS-08052) MMBT4403 - 40V 600mA SOT-23 (TRANS-09245); PROD_ID: TRANS-09245
Q4 Q7 = microbuilder:MOSFET-P: P-Channel Mosfet LEGEND VDS: Voltage Drain-Source ID: Drain Current RDS(ON): Drain-Source On-State Resistance VGS(TH): Gate-Source Threshold Voltage CISS: Drain-Source Input Capacitance SOT-23 Name VDS ID RDS(ON) VGS(TH) CISS Order Number IRLML5103 30V 760mA 600 mOhm -- 75pF @ 25V Digikey: IRLML5103PBFCT-ND IRLML6401 12V 4.3A 50 mOhm 950mV @ 250µA 830pF @ 10V Digikey: IRLML6401PBFTR-ND NTR0202PL 20V 400mA 800 mOhm 2.3V @ 250uA 70pF @ 5V Digikey: NTR0202PLT1GOSTR-ND NTR4101PT1G 20V 1.8A 85 mOhm 1.2V @ 250uA 675pF @ 10V Digikey: NTR4101PT1GOSCT-ND DMP2004K 20V 600mA 900 mOhm 1V @ 250uA 175pF @ 16V Digikey: DMP2004KDICT-ND PMV65XP 20V 3.9A 76 mOhm 950mV @ 1mA 725pF @ 20V Digikey: 568-2358-2-ND TO-252 Name VDS ID RDS(ON) VGS(TH) CISS Order Number AOD417 30V 25A 34 mOhm 3V @ 250µA 920pF @ 15V Digikey: 785-1106-2-ND PowerPak Name VDS ID RDS(ON) VGS(TH) CISS Order Number AON7401 30V 12A 14 mOhm 3V @ 250µA 2600pF @ 15V Digikey: 785-1302-1-ND
Q8 = SparkFun-DiscreteSemi:TRANS_NPN_DUAL: Dual NPN Transistors in Single Package The MBT3904W1 puts two general purpose 3904 NPN transistors in a single package. Datasheet <http://www.onsemi.com/pub_link/Collateral/MBT3904DW1T1-D.PDF> SparkFun Products: SparkFun ESP32 Thing <https://www.sparkfun.com/products/13907>; PROD_ID: TRANS-13337
R1 R12 R66 R67 R70 R86 = microbuilder:RESISTOR: Resistors
R2 R10 R15 R16 R21 R26 R64 R65 R68 R69 = SparkFun-Resistors:10KOHM-1/10W-1%(0603): RES-00824; PROD_ID: RES-00824
R3 = SparkFun-Resistors:220KOHM: 220kΩ resistor A resistor is a passive two-terminal electrical component that implements electrical resistance as a circuit element. Resistors act to reduce current flow, and, at the same time, act to lower voltage levels within circuits. - Wikipedia; PROD_ID: RES-08969; VALUE: 220k
R4 R6 R8 R13 R90 = SparkFun-Resistors:10KOHM: 10kΩ resistor A resistor is a passive two-terminal electrical component that implements electrical resistance as a circuit element. Resistors act to reduce current flow, and, at the same time, act to lower voltage levels within circuits. - Wikipedia; PROD_ID: RES-00824
R5 R9 R17 R18 R22 R23 = SparkFun-Resistors:100OHM-1/10W-1%(0603): RES-07863; PROD_ID: RES-07863
R11 R19 R24 = SparkFun-Resistors:8.2KOHM-1/10W-5%(0603): RES-10646; PROD_ID: RES-10646
R14 R20 R25 = SparkFun-Resistors:20KOHM1/10W1%(0603): RES-09383; PROD_ID: RES-09383
R27 R28 R34 R35 R41 R42 R48 R49 R55 R56 = rcl:R-EU_: RESISTOR, European symbol
R29 R36 R43 R50 R57 = we-rcl:POT: Potentiometer
R30-R33 R37-R40 R44-R47 R51-R54 R58-R61 = we-rcl:RESISTOR: Resistors
R62 R63 = SparkFun-Resistors:5.1KOHM; PROD_ID: RES-12083
R71-R85 = SparkFun-Resistors:22OHM: 22Ω resistor A resistor is a passive two-terminal electrical component that implements electrical resistance as a circuit element. Resistors act to reduce current flow, and, at the same time, act to lower voltage levels within circuits. - Wikipedia; PROD_ID: RES-08698
R87 R88 R91 REFF = adafruit:R-US_: RESISTOR, American symbol
R89 R92-R94 = SparkFun-Resistors:RESISTOR: Generic Resistor Package
ROTARY_SWITCH = B2B-PH-SM4-TB_LF__SN_:B5B-PH-SM4-TB
STEPPER1-STEPPER5 = NewKevinMade:S4B-PH-SM4_TB
U1 = microbuilder:PCA9685: PCA9685 - 16 Channel 12-Bit I2C PWM Controller 5.0V tolerant 16 channel, 12-bit I2C PWM controller with 25mA per output (max. 400mA total) Digikey: 568-5931-1-ND
U3 = microbuilder:HTU21DF: HTU21DF - Relative Humidity and Temperature Sensor
U4-U6 = Testing:HX711; PROD_ID: IC-12445
U7 = SparkFun-DigitalIC:SX1509: Semtech SX1509 The SX1509 is a complete ultra low voltage 1.2V to 3.6V General Purpose parallel Input/Output (GPIO) expanders ideal for low power handheld battery powered equipment. This version comes in a 16-channel configuration and allows easy serial expansion of I/O through a standard 400kHz I2C interface. GPIO devices can provide additional control and monitoring when the microcontroller or chipset has insufficient I/O ports, or in systems where serial communication and control from a remote location is advantageous.; PROD_ID: IC-11311
U$2 = mp1584S:MP1584_V2
U$4 U$48-U$50 = microbuilder:MOUNTINGHOLE: Mounting Hole For #2 screws (0.086"/2.18mm width, 0.094"/2.4mm hole) use 2.5mm; BOM: EXCLUDE
WEIGHT1-WEIGHT3 = NewKevinMade:S5B-PH-SM4_TB
X2 = microbuilder:ESP32_WROOM32

## Net classes
0 default: width 0.203 mm, drill 0.203 mm, clearance 0.203 mm
1 sig: width 0.305 mm, drill 0.305 mm, clearance 0.203 mm
2 Power: width 0.203 mm, drill 0.203 mm, clearance 0.203 mm
3 HighSpeedSig: width 0.152 mm, drill 0.152 mm, clearance 0.203 mm
4 StepperOut: width 0.381 mm, drill 0.381 mm, clearance 0.203 mm
5 LowPower: width 0.203 mm, drill 0.203 mm, clearance 0.203 mm